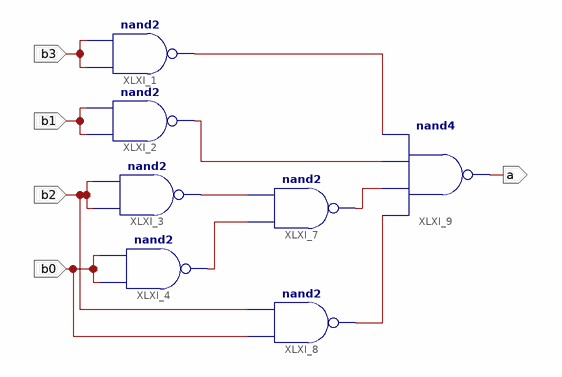
[diagram p0: schematic sheet 1]
// Xilinx ISE schematic a_block.sch (xc9500xl) as structural Verilog: 7 symbols, 5 ports
module a_block (
  input  b2,
  input  b0,
  input  b3,
  input  b1,
  output a
);

  wire XLXN_6, XLXN_16, XLXN_31, XLXN_32, XLXN_33, XLXN_35;

  nand XLXI_1 (XLXN_31, b3, b3);
  nand XLXI_2 (XLXN_32, b1, b1);
  nand XLXI_3 (XLXN_6, b2, b2);
  nand XLXI_4 (XLXN_16, b0, b0);
  nand XLXI_7 (XLXN_33, XLXN_16, XLXN_6);
  nand XLXI_8 (XLXN_35, b0, b2);
  nand XLXI_9 (a, XLXN_35, XLXN_33, XLXN_32, XLXN_31);
endmodule
